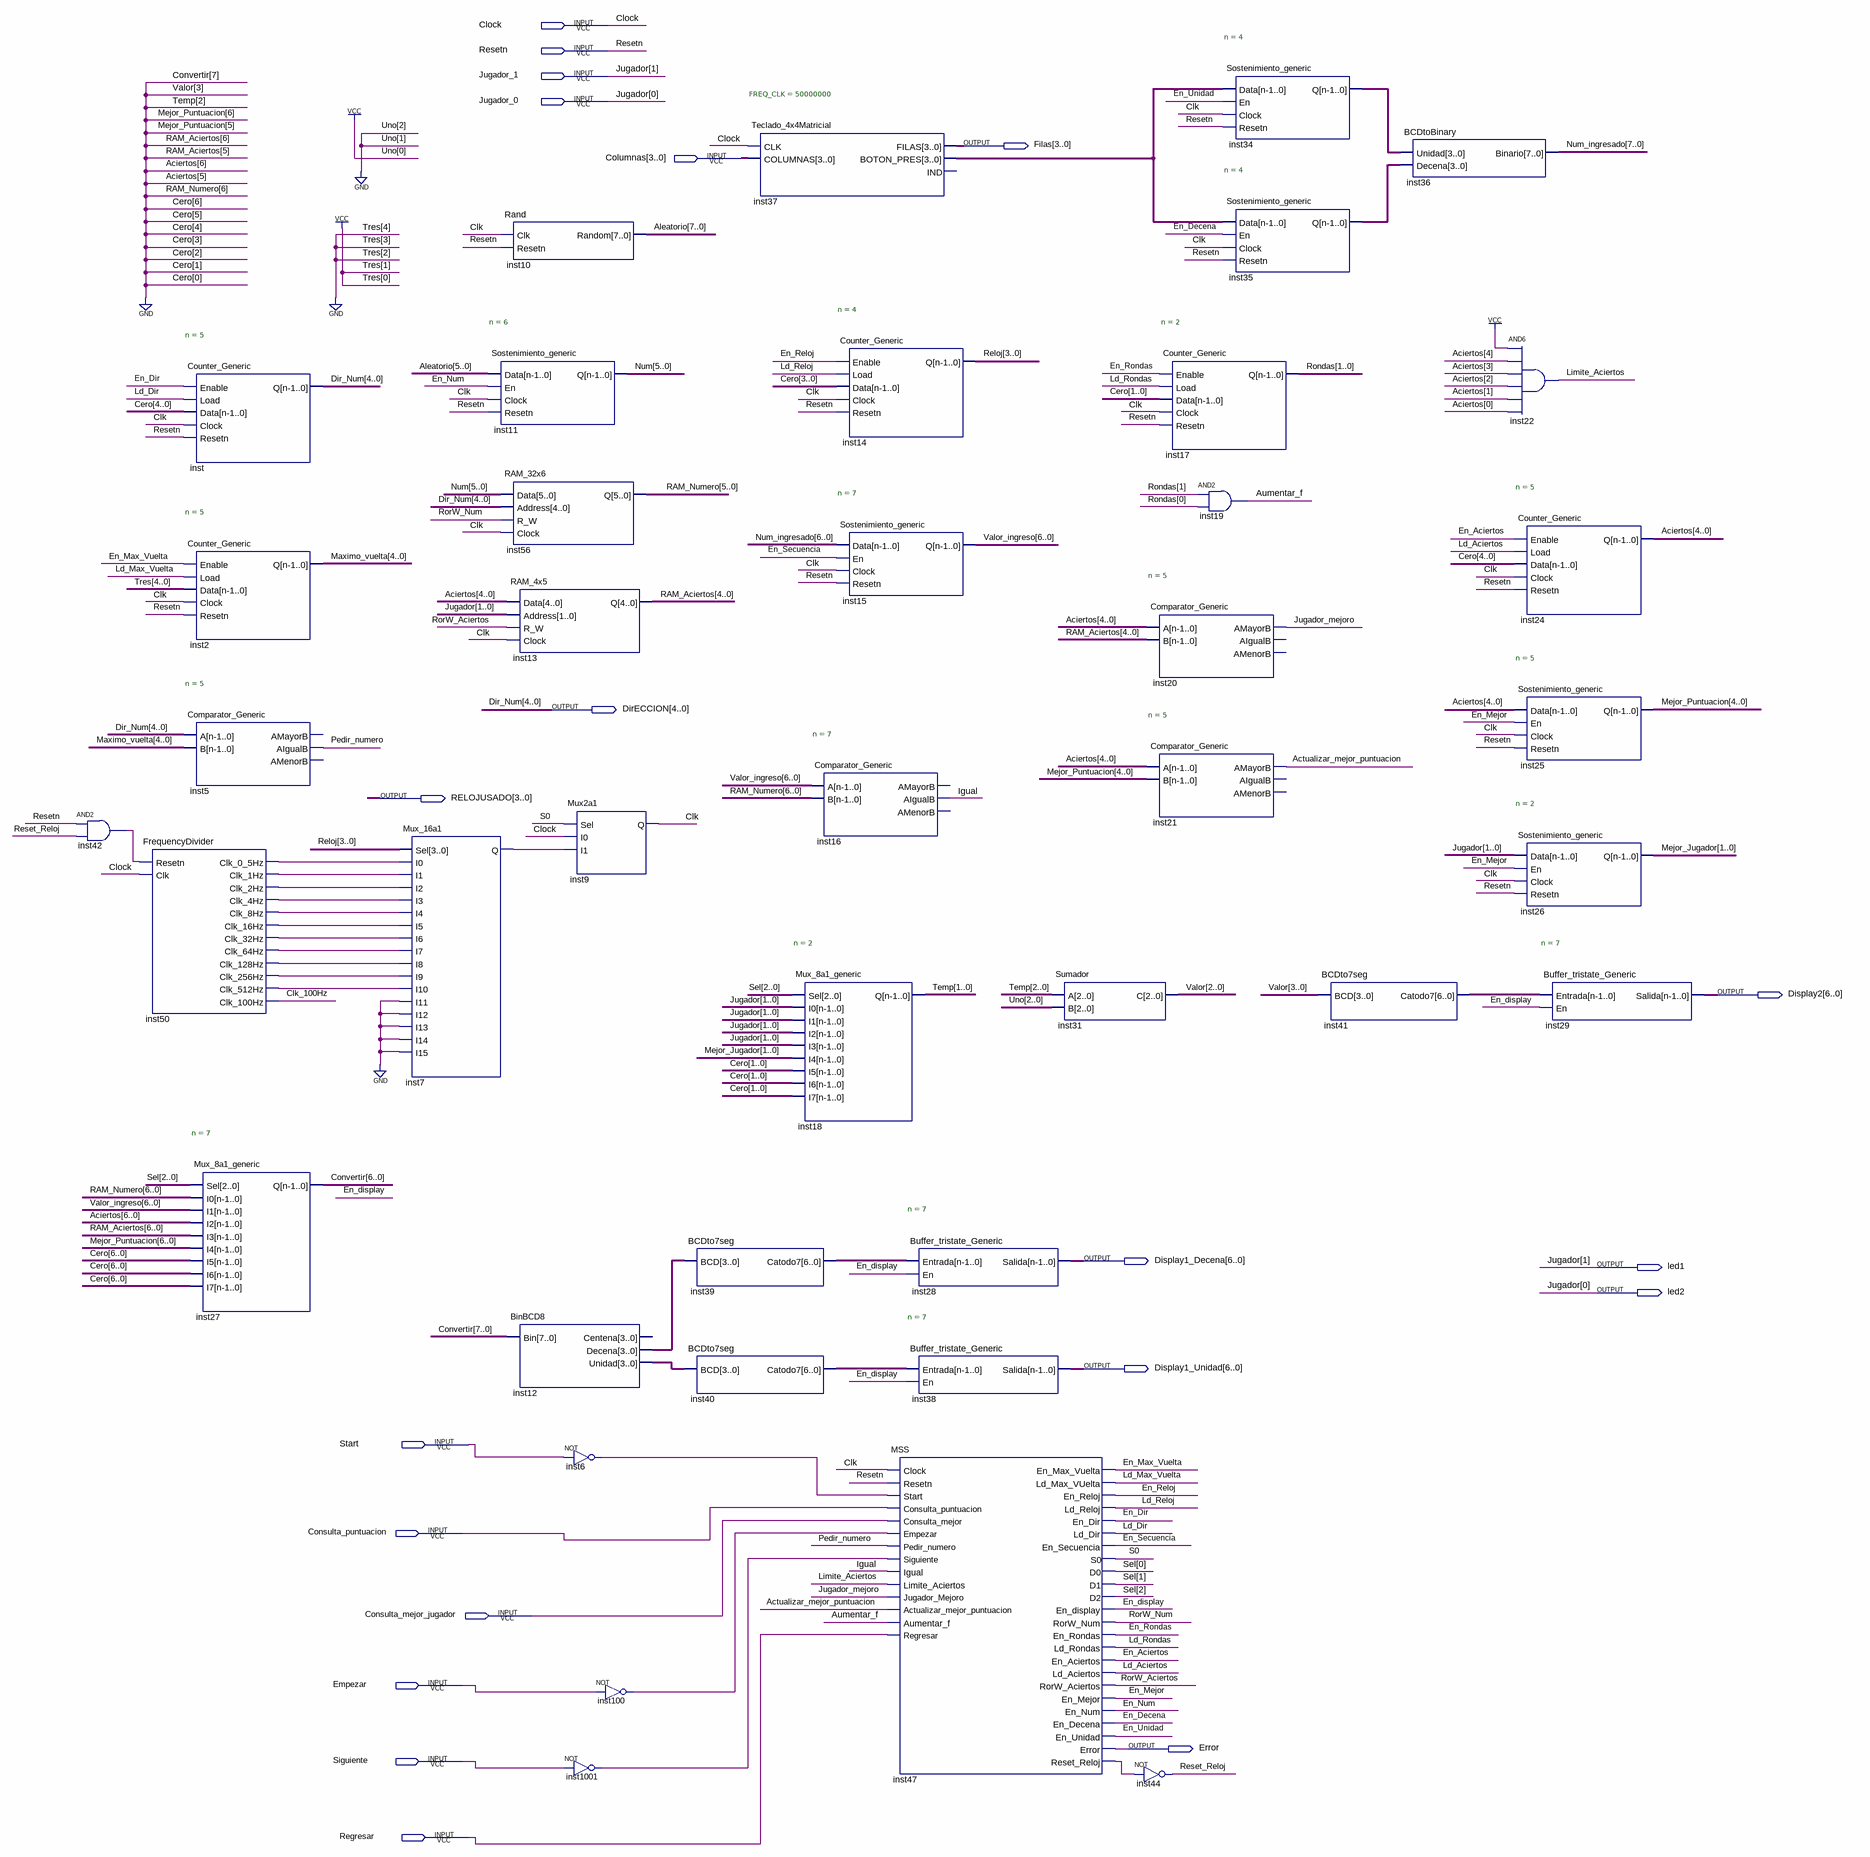
[diagram p0: schematic sheet]
// Quartus schematic Schematic.bdf as structural Verilog: 41 symbols, 20 pins
module Schematic (
  input  Clock,
  input  Resetn,
  input  Jugador_1,
  input  Jugador_0,
  input  [3:0] Columnas,
  input  Start,
  input  Consulta_puntuacion,
  input  Consulta_mejor_jugador,
  input  Empezar,
  input  Siguiente,
  input  Regresar,
  output [3:0] Filas,
  output [4:0] DirECCION,
  output [3:0] RELOJUSADO,
  output [6:0] Display2,
  output [6:0] Display1_Decena,
  output led1,
  output led2,
  output [6:0] Display1_Unidad,
  output Error
);

  wire Actualizar_mejor_puntuacion, Aumentar_f, Clk, Clk_100Hz, En_Aciertos, En_Decena, En_Dir, En_display,
       En_Max_Vuelta, En_Mejor, En_Num, En_Reloj, En_Rondas, En_Secuencia, En_Unidad, Igual, inst6_out,
       inst7_q, inst42_out, inst47_reset_reloj, inst50_clk_0_5hz, inst50_clk_1hz, inst50_clk_2hz,
       inst50_clk_4hz, inst50_clk_8hz, inst50_clk_16hz, inst50_clk_32hz, inst50_clk_64hz, inst50_clk_128hz,
       inst50_clk_256hz, inst50_clk_512hz, inst100_out, inst1001_out, Jugador_mejoro, Ld_Aciertos, Ld_Dir,
       Ld_Max_Vuelta, Ld_Reloj, Ld_Rondas, Limite_Aciertos, Pedir_numero, Reset_Reloj, RorW_Aciertos,
       RorW_Num, S0;
  wire [1:0] Mejor_Jugador, Rondas, Temp;
  wire [2:0] Sel, Valor;
  wire [3:0] inst12_decena, inst12_unidad, inst34_q, inst35_q, inst37_boton_pres, Reloj;
  wire [4:0] Aciertos, Maximo_vuelta, Mejor_Puntuacion, RAM_Aciertos;
  wire [5:0] Num, RAM_Numero;
  wire [6:0] Convertir, inst39_catodo7, inst40_catodo7, inst41_catodo7, Valor_ingreso;
  wire [7:0] Aleatorio, Num_ingresado;

  and inst42 (inst42_out, Resetn, Reset_Reloj);
  FrequencyDivider inst50 (
    .Resetn(inst42_out), .Clk(Clock), .Clk_0_5Hz(inst50_clk_0_5hz), .Clk_1Hz(inst50_clk_1hz),
    .Clk_2Hz(inst50_clk_2hz), .Clk_4Hz(inst50_clk_4hz), .Clk_8Hz(inst50_clk_8hz), .Clk_16Hz(inst50_clk_16hz),
    .Clk_32Hz(inst50_clk_32hz), .Clk_64Hz(inst50_clk_64hz), .Clk_128Hz(inst50_clk_128hz),
    .Clk_256Hz(inst50_clk_256hz), .Clk_512Hz(inst50_clk_512hz), .Clk_100Hz(Clk_100Hz));
  Counter_Generic #(.n(5)) inst (
    .Enable(En_Dir), .Load(Ld_Dir), .Data({5{1'b0}}), .Clock(Clk), .Resetn(Resetn), .Q(DirECCION));
  Counter_Generic #(.n(5)) inst2 (
    .Enable(En_Max_Vuelta), .Load(Ld_Max_Vuelta), .Data(5'b00011), .Clock(Clk), .Resetn(Resetn),
    .Q(Maximo_vuelta));
  Comparator_Generic #(.n(5)) inst5 (
    .A(DirECCION), .B(Maximo_vuelta), .AIgualB(Pedir_numero));  // open: AMayorB, AMenorB
  Mux_8a1_generic #(.n(7)) inst27 (
    .Sel(Sel), .I0({1'b0, RAM_Numero}), .I1(Valor_ingreso), .I2({2'b00, Aciertos}),
    .I3({2'b00, RAM_Aciertos}), .I4({2'b00, Mejor_Puntuacion}), .I5({7{1'b0}}), .I6({7{1'b0}}),
    .I7({7{1'b0}}), .Q(Convertir));
  Mux_16a1 inst7 (
    .Sel(Reloj), .I0(inst50_clk_0_5hz), .I1(inst50_clk_1hz), .I2(inst50_clk_2hz), .I3(inst50_clk_4hz),
    .I4(inst50_clk_8hz), .I5(inst50_clk_16hz), .I6(inst50_clk_32hz), .I7(inst50_clk_64hz),
    .I8(inst50_clk_128hz), .I9(inst50_clk_256hz), .I10(inst50_clk_512hz), .I11(1'b0), .I12(1'b0), .I13(1'b0),
    .I14(1'b0), .I15(1'b0), .Q(inst7_q));
  Rand inst10 (.Clk(Clk), .Resetn(Resetn), .Random(Aleatorio));
  Sostenimiento_generic #(.n(6)) inst11 (.Data(Aleatorio[5:0]), .En(En_Num), .Clock(Clk), .Resetn(Resetn), .Q(Num));
  RAM_32x6 inst56 (.Data(Num), .Address(DirECCION), .R_W(RorW_Num), .Clock(Clk), .Q(RAM_Numero));
  RAM_4x5 inst13 (
    .Data(Aciertos), .Address({Jugador_1, Jugador_0}), .R_W(RorW_Aciertos), .Clock(Clk), .Q(RAM_Aciertos));
  BinBCD8 inst12 (.Bin({1'b0, Convertir}), .Decena(inst12_decena), .Unidad(inst12_unidad));  // open: Centena
  Mux2a1 inst9 (.Sel(S0), .I0(Clock), .I1(inst7_q), .Q(Clk));
  not inst6 (inst6_out, Start);
  not inst100 (inst100_out, Empezar);
  not inst1001 (inst1001_out, Siguiente);
  BCDto7seg inst39 (.BCD(inst12_decena), .Catodo7(inst39_catodo7));
  BCDto7seg inst40 (.BCD(inst12_unidad), .Catodo7(inst40_catodo7));
  Teclado_4x4Matricial #(.FREQ_CLK(50000000)) inst37 (
    .CLK(Clock), .COLUMNAS(Columnas), .FILAS(Filas), .BOTON_PRES(inst37_boton_pres));  // open: IND
  Mux_8a1_generic #(.n(2)) inst18 (
    .Sel(Sel), .I0({Jugador_1, Jugador_0}), .I1({Jugador_1, Jugador_0}), .I2({Jugador_1, Jugador_0}),
    .I3({Jugador_1, Jugador_0}), .I4(Mejor_Jugador), .I5(2'b00), .I6(2'b00), .I7(2'b00), .Q(Temp));
  Counter_Generic #(.n(4)) inst14 (
    .Enable(En_Reloj), .Load(Ld_Reloj), .Data(4'b0000), .Clock(Clk), .Resetn(Resetn), .Q(Reloj));
  Sostenimiento_generic #(.n(7)) inst15 (
    .Data(Num_ingresado[6:0]), .En(En_Secuencia), .Clock(Clk), .Resetn(Resetn), .Q(Valor_ingreso));
  Comparator_Generic #(.n(7)) inst16 (
    .A(Valor_ingreso), .B({1'b0, RAM_Numero}), .AIgualB(Igual));  // open: AMayorB, AMenorB
  Buffer_tristate_Generic #(.n(7)) inst28 (.Entrada(inst39_catodo7), .En(En_display), .Salida(Display1_Decena));
  Buffer_tristate_Generic #(.n(7)) inst38 (.Entrada(inst40_catodo7), .En(En_display), .Salida(Display1_Unidad));
  MSS inst47 (
    .Clock(Clk), .Resetn(Resetn), .Start(inst6_out), .Consulta_puntuacion(Consulta_puntuacion),
    .Consulta_mejor(Consulta_mejor_jugador), .Empezar(inst100_out), .Pedir_numero(Pedir_numero),
    .Siguiente(inst1001_out), .Igual(Igual), .Limite_Aciertos(Limite_Aciertos),
    .Jugador_Mejoro(Jugador_mejoro), .Actualizar_mejor_puntuacion(Actualizar_mejor_puntuacion),
    .Aumentar_f(Aumentar_f), .Regresar(Regresar), .En_Max_Vuelta(En_Max_Vuelta),
    .Ld_Max_VUelta(Ld_Max_Vuelta), .En_Reloj(En_Reloj), .Ld_Reloj(Ld_Reloj), .En_Dir(En_Dir),
    .Ld_Dir(Ld_Dir), .En_Secuencia(En_Secuencia), .S0(S0), .D0(Sel[0]), .D1(Sel[1]), .D2(Sel[2]),
    .En_display(En_display), .RorW_Num(RorW_Num), .En_Rondas(En_Rondas), .Ld_Rondas(Ld_Rondas),
    .En_Aciertos(En_Aciertos), .Ld_Aciertos(Ld_Aciertos), .RorW_Aciertos(RorW_Aciertos), .En_Mejor(En_Mejor),
    .En_Num(En_Num), .En_Decena(En_Decena), .En_Unidad(En_Unidad), .Error(Error),
    .Reset_Reloj(inst47_reset_reloj));
  Sumador inst31 (.A({1'b0, Temp}), .B(3'b001), .C(Valor));
  Counter_Generic #(.n(2)) inst17 (
    .Enable(En_Rondas), .Load(Ld_Rondas), .Data(2'b00), .Clock(Clk), .Resetn(Resetn), .Q(Rondas));
  Comparator_Generic #(.n(5)) inst20 (
    .A(Aciertos), .B(RAM_Aciertos), .AMayorB(Jugador_mejoro));  // open: AIgualB, AMenorB
  Comparator_Generic #(.n(5)) inst21 (
    .A(Aciertos), .B(Mejor_Puntuacion), .AMayorB(Actualizar_mejor_puntuacion));  // open: AIgualB, AMenorB
  not inst44 (Reset_Reloj, inst47_reset_reloj);
  and inst19 (Aumentar_f, Rondas[1], Rondas[0]);
  Sostenimiento_generic #(.n(4)) inst34 (
    .Data(inst37_boton_pres), .En(En_Unidad), .Clock(Clk), .Resetn(Resetn), .Q(inst34_q));
  Sostenimiento_generic #(.n(4)) inst35 (
    .Data(inst37_boton_pres), .En(En_Decena), .Clock(Clk), .Resetn(Resetn), .Q(inst35_q));
  BCDto7seg inst41 (.BCD({1'b0, Valor}), .Catodo7(inst41_catodo7));
  BCDtoBinary inst36 (.Unidad(inst34_q), .Decena(inst35_q), .Binario(Num_ingresado));
  and inst22 (Limite_Aciertos, 1'b1, Aciertos[4], Aciertos[3], Aciertos[2], Aciertos[1], Aciertos[0]);
  Counter_Generic #(.n(5)) inst24 (
    .Enable(En_Aciertos), .Load(Ld_Aciertos), .Data({5{1'b0}}), .Clock(Clk), .Resetn(Resetn), .Q(Aciertos));
  Sostenimiento_generic #(.n(5)) inst25 (
    .Data(Aciertos), .En(En_Mejor), .Clock(Clk), .Resetn(Resetn), .Q(Mejor_Puntuacion));
  Sostenimiento_generic #(.n(2)) inst26 (
    .Data({Jugador_1, Jugador_0}), .En(En_Mejor), .Clock(Clk), .Resetn(Resetn), .Q(Mejor_Jugador));
  Buffer_tristate_Generic #(.n(7)) inst29 (.Entrada(inst41_catodo7), .En(En_display), .Salida(Display2));

  assign led1 = Jugador_1;
  assign led2 = Jugador_0;

  // Other names for the same wires on the sheet: Dir_Num[4:0] = DirECCION; Jugador[1:0] = {Jugador_1, Jugador_0}
endmodule
